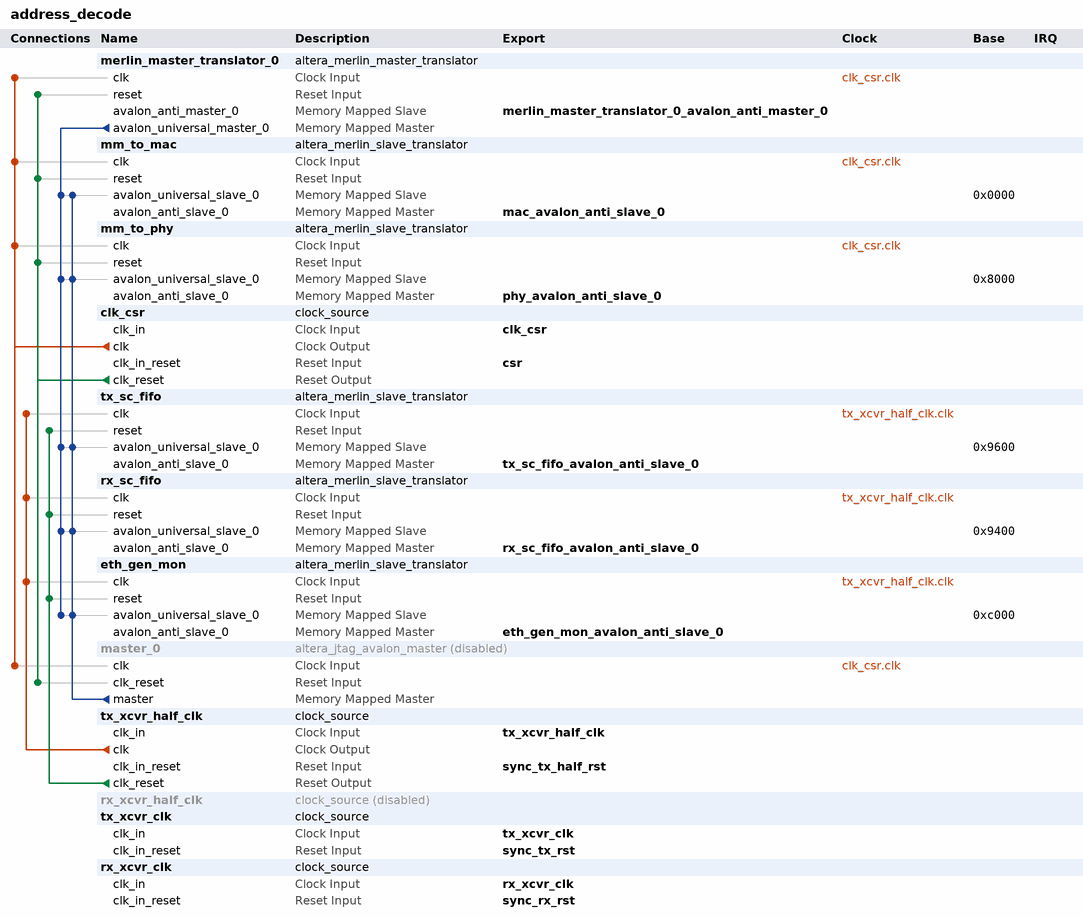
[diagram p0: system contents]
# Platform Designer (Qsys) system address_decode, Arria 10 10AX115N3F40E2SG
# Parameters at their usual value, and those the tool derives, are not listed.
package require -exact qsys 17.0
create_system address_decode
set_project_property DEVICE_FAMILY {Arria 10}
set_project_property DEVICE 10AX115N3F40E2SG

add_instance merlin_master_translator_0 altera_merlin_master_translator 17.0
set_instance_parameter_value merlin_master_translator_0 AV_ADDRESSGROUP 0
set_instance_parameter_value merlin_master_translator_0 AV_ADDRESS_SYMBOLS 0
set_instance_parameter_value merlin_master_translator_0 AV_ADDRESS_W 16
set_instance_parameter_value merlin_master_translator_0 AV_ALWAYSBURSTMAXBURST 0
set_instance_parameter_value merlin_master_translator_0 AV_BITS_PER_SYMBOL 8
set_instance_parameter_value merlin_master_translator_0 AV_BURSTBOUNDARIES 0
set_instance_parameter_value merlin_master_translator_0 AV_BURSTCOUNT_SYMBOLS 0
set_instance_parameter_value merlin_master_translator_0 AV_BURSTCOUNT_W 1
set_instance_parameter_value merlin_master_translator_0 AV_BYTEENABLE_W 4
set_instance_parameter_value merlin_master_translator_0 AV_CONSTANT_BURST_BEHAVIOR 0
set_instance_parameter_value merlin_master_translator_0 AV_DATA_HOLD 0
set_instance_parameter_value merlin_master_translator_0 AV_DATA_W 32
set_instance_parameter_value merlin_master_translator_0 AV_INTERLEAVEBURSTS 0
set_instance_parameter_value merlin_master_translator_0 AV_ISBIGENDIAN 0
set_instance_parameter_value merlin_master_translator_0 AV_LINEWRAPBURSTS 0
set_instance_parameter_value merlin_master_translator_0 AV_MAX_PENDING_READ_TRANSACTIONS 0
set_instance_parameter_value merlin_master_translator_0 AV_READLATENCY 0
set_instance_parameter_value merlin_master_translator_0 AV_READ_WAIT 0
set_instance_parameter_value merlin_master_translator_0 AV_REGISTERINCOMINGSIGNALS 0
set_instance_parameter_value merlin_master_translator_0 AV_REGISTEROUTGOINGSIGNALS 0
set_instance_parameter_value merlin_master_translator_0 AV_SETUP_WAIT 0
set_instance_parameter_value merlin_master_translator_0 AV_SYMBOLS_PER_WORD 4
set_instance_parameter_value merlin_master_translator_0 AV_WRITE_WAIT 0
set_instance_parameter_value merlin_master_translator_0 SYNC_RESET 0
set_instance_parameter_value merlin_master_translator_0 UAV_ADDRESSGROUP 0
set_instance_parameter_value merlin_master_translator_0 UAV_ADDRESS_W 32
set_instance_parameter_value merlin_master_translator_0 UAV_BURSTCOUNT_W 10
set_instance_parameter_value merlin_master_translator_0 UAV_CONSTANT_BURST_BEHAVIOR 0
set_instance_parameter_value merlin_master_translator_0 USE_ADDRESS 1
set_instance_parameter_value merlin_master_translator_0 USE_BEGINBURSTTRANSFER 0
set_instance_parameter_value merlin_master_translator_0 USE_BEGINTRANSFER 0
set_instance_parameter_value merlin_master_translator_0 USE_BURSTCOUNT 0
set_instance_parameter_value merlin_master_translator_0 USE_BYTEENABLE 0
set_instance_parameter_value merlin_master_translator_0 USE_CHIPSELECT 0
set_instance_parameter_value merlin_master_translator_0 USE_CLKEN 0
set_instance_parameter_value merlin_master_translator_0 USE_DEBUGACCESS 0
set_instance_parameter_value merlin_master_translator_0 USE_LOCK 0
set_instance_parameter_value merlin_master_translator_0 USE_READ 1
set_instance_parameter_value merlin_master_translator_0 USE_READDATA 1
set_instance_parameter_value merlin_master_translator_0 USE_READDATAVALID 0
set_instance_parameter_value merlin_master_translator_0 USE_READRESPONSE 0
set_instance_parameter_value merlin_master_translator_0 USE_WAITREQUEST 1
set_instance_parameter_value merlin_master_translator_0 USE_WRITE 1
set_instance_parameter_value merlin_master_translator_0 USE_WRITEDATA 1
set_instance_parameter_value merlin_master_translator_0 USE_WRITERESPONSE 0

add_instance mm_to_mac altera_merlin_slave_translator 17.0
set_instance_parameter_value mm_to_mac AV_ADDRESSGROUP 0
set_instance_parameter_value mm_to_mac AV_ADDRESS_SYMBOLS 0
set_instance_parameter_value mm_to_mac AV_ADDRESS_W 13
set_instance_parameter_value mm_to_mac AV_ALWAYSBURSTMAXBURST 0
set_instance_parameter_value mm_to_mac AV_BITS_PER_SYMBOL 8
set_instance_parameter_value mm_to_mac AV_BURSTBOUNDARIES 0
set_instance_parameter_value mm_to_mac AV_BURSTCOUNT_SYMBOLS 0
set_instance_parameter_value mm_to_mac AV_BURSTCOUNT_W 4
set_instance_parameter_value mm_to_mac AV_BYTEENABLE_W 4
set_instance_parameter_value mm_to_mac AV_CONSTANT_BURST_BEHAVIOR 0
set_instance_parameter_value mm_to_mac AV_DATA_HOLD 0
set_instance_parameter_value mm_to_mac AV_DATA_W 32
set_instance_parameter_value mm_to_mac AV_INTERLEAVEBURSTS 0
set_instance_parameter_value mm_to_mac AV_ISBIGENDIAN 0
set_instance_parameter_value mm_to_mac AV_LINEWRAPBURSTS 0
set_instance_parameter_value mm_to_mac AV_MAX_PENDING_READ_TRANSACTIONS 64
set_instance_parameter_value mm_to_mac AV_MAX_PENDING_WRITE_TRANSACTIONS 0
set_instance_parameter_value mm_to_mac AV_READLATENCY 0
set_instance_parameter_value mm_to_mac AV_READ_WAIT 1
set_instance_parameter_value mm_to_mac AV_REGISTERINCOMINGSIGNALS 0
set_instance_parameter_value mm_to_mac AV_REGISTEROUTGOINGSIGNALS 0
set_instance_parameter_value mm_to_mac AV_REQUIRE_UNALIGNED_ADDRESSES 0
set_instance_parameter_value mm_to_mac AV_SETUP_WAIT 0
set_instance_parameter_value mm_to_mac AV_SYMBOLS_PER_WORD 4
set_instance_parameter_value mm_to_mac AV_TIMING_UNITS 1
set_instance_parameter_value mm_to_mac AV_WRITE_WAIT 0
set_instance_parameter_value mm_to_mac CHIPSELECT_THROUGH_READLATENCY 0
set_instance_parameter_value mm_to_mac CLOCK_RATE 125000000
set_instance_parameter_value mm_to_mac UAV_ADDRESSGROUP 0
set_instance_parameter_value mm_to_mac UAV_ADDRESS_W 15
set_instance_parameter_value mm_to_mac UAV_BURSTCOUNT_W 4
set_instance_parameter_value mm_to_mac UAV_BYTEENABLE_W 4
set_instance_parameter_value mm_to_mac UAV_CONSTANT_BURST_BEHAVIOR 0
set_instance_parameter_value mm_to_mac UAV_DATA_W 32
set_instance_parameter_value mm_to_mac USE_ADDRESS 1
set_instance_parameter_value mm_to_mac USE_AV_CLKEN 0
set_instance_parameter_value mm_to_mac USE_BEGINBURSTTRANSFER 0
set_instance_parameter_value mm_to_mac USE_BEGINTRANSFER 0
set_instance_parameter_value mm_to_mac USE_BURSTCOUNT 0
set_instance_parameter_value mm_to_mac USE_BYTEENABLE 0
set_instance_parameter_value mm_to_mac USE_CHIPSELECT 0
set_instance_parameter_value mm_to_mac USE_DEBUGACCESS 0
set_instance_parameter_value mm_to_mac USE_LOCK 0
set_instance_parameter_value mm_to_mac USE_OUTPUTENABLE 0
set_instance_parameter_value mm_to_mac USE_READ 1
set_instance_parameter_value mm_to_mac USE_READDATA 1
set_instance_parameter_value mm_to_mac USE_READDATAVALID 0
set_instance_parameter_value mm_to_mac USE_READRESPONSE 0
set_instance_parameter_value mm_to_mac USE_UAV_CLKEN 0
set_instance_parameter_value mm_to_mac USE_WAITREQUEST 1
set_instance_parameter_value mm_to_mac USE_WRITE 1
set_instance_parameter_value mm_to_mac USE_WRITEBYTEENABLE 0
set_instance_parameter_value mm_to_mac USE_WRITEDATA 1
set_instance_parameter_value mm_to_mac USE_WRITERESPONSE 0

add_instance mm_to_phy altera_merlin_slave_translator 17.0
set_instance_parameter_value mm_to_phy AV_ADDRESSGROUP 0
set_instance_parameter_value mm_to_phy AV_ADDRESS_SYMBOLS 0
set_instance_parameter_value mm_to_phy AV_ADDRESS_W 10
set_instance_parameter_value mm_to_phy AV_ALWAYSBURSTMAXBURST 0
set_instance_parameter_value mm_to_phy AV_BITS_PER_SYMBOL 8
set_instance_parameter_value mm_to_phy AV_BURSTBOUNDARIES 0
set_instance_parameter_value mm_to_phy AV_BURSTCOUNT_SYMBOLS 0
set_instance_parameter_value mm_to_phy AV_BURSTCOUNT_W 4
set_instance_parameter_value mm_to_phy AV_BYTEENABLE_W 4
set_instance_parameter_value mm_to_phy AV_CONSTANT_BURST_BEHAVIOR 0
set_instance_parameter_value mm_to_phy AV_DATA_HOLD 0
set_instance_parameter_value mm_to_phy AV_DATA_W 32
set_instance_parameter_value mm_to_phy AV_INTERLEAVEBURSTS 0
set_instance_parameter_value mm_to_phy AV_ISBIGENDIAN 0
set_instance_parameter_value mm_to_phy AV_LINEWRAPBURSTS 0
set_instance_parameter_value mm_to_phy AV_MAX_PENDING_READ_TRANSACTIONS 64
set_instance_parameter_value mm_to_phy AV_MAX_PENDING_WRITE_TRANSACTIONS 0
set_instance_parameter_value mm_to_phy AV_READLATENCY 0
set_instance_parameter_value mm_to_phy AV_READ_WAIT 1
set_instance_parameter_value mm_to_phy AV_REGISTERINCOMINGSIGNALS 0
set_instance_parameter_value mm_to_phy AV_REGISTEROUTGOINGSIGNALS 0
set_instance_parameter_value mm_to_phy AV_REQUIRE_UNALIGNED_ADDRESSES 0
set_instance_parameter_value mm_to_phy AV_SETUP_WAIT 0
set_instance_parameter_value mm_to_phy AV_SYMBOLS_PER_WORD 4
set_instance_parameter_value mm_to_phy AV_TIMING_UNITS 1
set_instance_parameter_value mm_to_phy AV_WRITE_WAIT 0
set_instance_parameter_value mm_to_phy CHIPSELECT_THROUGH_READLATENCY 0
set_instance_parameter_value mm_to_phy CLOCK_RATE 125000000
set_instance_parameter_value mm_to_phy UAV_ADDRESSGROUP 0
set_instance_parameter_value mm_to_phy UAV_ADDRESS_W 12
set_instance_parameter_value mm_to_phy UAV_BURSTCOUNT_W 4
set_instance_parameter_value mm_to_phy UAV_BYTEENABLE_W 4
set_instance_parameter_value mm_to_phy UAV_CONSTANT_BURST_BEHAVIOR 0
set_instance_parameter_value mm_to_phy UAV_DATA_W 32
set_instance_parameter_value mm_to_phy USE_ADDRESS 1
set_instance_parameter_value mm_to_phy USE_AV_CLKEN 0
set_instance_parameter_value mm_to_phy USE_BEGINBURSTTRANSFER 0
set_instance_parameter_value mm_to_phy USE_BEGINTRANSFER 0
set_instance_parameter_value mm_to_phy USE_BURSTCOUNT 0
set_instance_parameter_value mm_to_phy USE_BYTEENABLE 0
set_instance_parameter_value mm_to_phy USE_CHIPSELECT 0
set_instance_parameter_value mm_to_phy USE_DEBUGACCESS 0
set_instance_parameter_value mm_to_phy USE_LOCK 0
set_instance_parameter_value mm_to_phy USE_OUTPUTENABLE 0
set_instance_parameter_value mm_to_phy USE_READ 1
set_instance_parameter_value mm_to_phy USE_READDATA 1
set_instance_parameter_value mm_to_phy USE_READDATAVALID 0
set_instance_parameter_value mm_to_phy USE_READRESPONSE 0
set_instance_parameter_value mm_to_phy USE_UAV_CLKEN 0
set_instance_parameter_value mm_to_phy USE_WAITREQUEST 1
set_instance_parameter_value mm_to_phy USE_WRITE 1
set_instance_parameter_value mm_to_phy USE_WRITEBYTEENABLE 0
set_instance_parameter_value mm_to_phy USE_WRITEDATA 1
set_instance_parameter_value mm_to_phy USE_WRITERESPONSE 0

add_instance clk_csr clock_source 17.0
set_instance_parameter_value clk_csr clockFrequency 125000000
set_instance_parameter_value clk_csr resetSynchronousEdges DEASSERT

add_instance tx_sc_fifo altera_merlin_slave_translator 17.0
set_instance_parameter_value tx_sc_fifo AV_ADDRESSGROUP 0
set_instance_parameter_value tx_sc_fifo AV_ADDRESS_SYMBOLS 0
set_instance_parameter_value tx_sc_fifo AV_ADDRESS_W 3
set_instance_parameter_value tx_sc_fifo AV_ALWAYSBURSTMAXBURST 0
set_instance_parameter_value tx_sc_fifo AV_BITS_PER_SYMBOL 8
set_instance_parameter_value tx_sc_fifo AV_BURSTBOUNDARIES 0
set_instance_parameter_value tx_sc_fifo AV_BURSTCOUNT_SYMBOLS 0
set_instance_parameter_value tx_sc_fifo AV_BURSTCOUNT_W 4
set_instance_parameter_value tx_sc_fifo AV_BYTEENABLE_W 4
set_instance_parameter_value tx_sc_fifo AV_CONSTANT_BURST_BEHAVIOR 0
set_instance_parameter_value tx_sc_fifo AV_DATA_HOLD 0
set_instance_parameter_value tx_sc_fifo AV_DATA_W 32
set_instance_parameter_value tx_sc_fifo AV_INTERLEAVEBURSTS 0
set_instance_parameter_value tx_sc_fifo AV_ISBIGENDIAN 0
set_instance_parameter_value tx_sc_fifo AV_LINEWRAPBURSTS 0
set_instance_parameter_value tx_sc_fifo AV_MAX_PENDING_READ_TRANSACTIONS 64
set_instance_parameter_value tx_sc_fifo AV_MAX_PENDING_WRITE_TRANSACTIONS 0
set_instance_parameter_value tx_sc_fifo AV_READLATENCY 0
set_instance_parameter_value tx_sc_fifo AV_READ_WAIT 1
set_instance_parameter_value tx_sc_fifo AV_REGISTERINCOMINGSIGNALS 0
set_instance_parameter_value tx_sc_fifo AV_REGISTEROUTGOINGSIGNALS 0
set_instance_parameter_value tx_sc_fifo AV_REQUIRE_UNALIGNED_ADDRESSES 0
set_instance_parameter_value tx_sc_fifo AV_SETUP_WAIT 0
set_instance_parameter_value tx_sc_fifo AV_SYMBOLS_PER_WORD 4
set_instance_parameter_value tx_sc_fifo AV_TIMING_UNITS 1
set_instance_parameter_value tx_sc_fifo AV_WRITE_WAIT 0
set_instance_parameter_value tx_sc_fifo CHIPSELECT_THROUGH_READLATENCY 0
set_instance_parameter_value tx_sc_fifo CLOCK_RATE 161132800
set_instance_parameter_value tx_sc_fifo UAV_ADDRESSGROUP 0
set_instance_parameter_value tx_sc_fifo UAV_ADDRESS_W 5
set_instance_parameter_value tx_sc_fifo UAV_BURSTCOUNT_W 4
set_instance_parameter_value tx_sc_fifo UAV_BYTEENABLE_W 4
set_instance_parameter_value tx_sc_fifo UAV_CONSTANT_BURST_BEHAVIOR 0
set_instance_parameter_value tx_sc_fifo UAV_DATA_W 32
set_instance_parameter_value tx_sc_fifo USE_ADDRESS 1
set_instance_parameter_value tx_sc_fifo USE_AV_CLKEN 0
set_instance_parameter_value tx_sc_fifo USE_BEGINBURSTTRANSFER 0
set_instance_parameter_value tx_sc_fifo USE_BEGINTRANSFER 0
set_instance_parameter_value tx_sc_fifo USE_BURSTCOUNT 0
set_instance_parameter_value tx_sc_fifo USE_BYTEENABLE 0
set_instance_parameter_value tx_sc_fifo USE_CHIPSELECT 0
set_instance_parameter_value tx_sc_fifo USE_DEBUGACCESS 0
set_instance_parameter_value tx_sc_fifo USE_LOCK 0
set_instance_parameter_value tx_sc_fifo USE_OUTPUTENABLE 0
set_instance_parameter_value tx_sc_fifo USE_READ 1
set_instance_parameter_value tx_sc_fifo USE_READDATA 1
set_instance_parameter_value tx_sc_fifo USE_READDATAVALID 0
set_instance_parameter_value tx_sc_fifo USE_READRESPONSE 0
set_instance_parameter_value tx_sc_fifo USE_UAV_CLKEN 0
set_instance_parameter_value tx_sc_fifo USE_WAITREQUEST 0
set_instance_parameter_value tx_sc_fifo USE_WRITE 1
set_instance_parameter_value tx_sc_fifo USE_WRITEBYTEENABLE 0
set_instance_parameter_value tx_sc_fifo USE_WRITEDATA 1
set_instance_parameter_value tx_sc_fifo USE_WRITERESPONSE 0

add_instance rx_sc_fifo altera_merlin_slave_translator 17.0
set_instance_parameter_value rx_sc_fifo AV_ADDRESSGROUP 0
set_instance_parameter_value rx_sc_fifo AV_ADDRESS_SYMBOLS 0
set_instance_parameter_value rx_sc_fifo AV_ADDRESS_W 3
set_instance_parameter_value rx_sc_fifo AV_ALWAYSBURSTMAXBURST 0
set_instance_parameter_value rx_sc_fifo AV_BITS_PER_SYMBOL 8
set_instance_parameter_value rx_sc_fifo AV_BURSTBOUNDARIES 0
set_instance_parameter_value rx_sc_fifo AV_BURSTCOUNT_SYMBOLS 0
set_instance_parameter_value rx_sc_fifo AV_BURSTCOUNT_W 4
set_instance_parameter_value rx_sc_fifo AV_BYTEENABLE_W 4
set_instance_parameter_value rx_sc_fifo AV_CONSTANT_BURST_BEHAVIOR 0
set_instance_parameter_value rx_sc_fifo AV_DATA_HOLD 0
set_instance_parameter_value rx_sc_fifo AV_DATA_W 32
set_instance_parameter_value rx_sc_fifo AV_INTERLEAVEBURSTS 0
set_instance_parameter_value rx_sc_fifo AV_ISBIGENDIAN 0
set_instance_parameter_value rx_sc_fifo AV_LINEWRAPBURSTS 0
set_instance_parameter_value rx_sc_fifo AV_MAX_PENDING_READ_TRANSACTIONS 64
set_instance_parameter_value rx_sc_fifo AV_MAX_PENDING_WRITE_TRANSACTIONS 0
set_instance_parameter_value rx_sc_fifo AV_READLATENCY 0
set_instance_parameter_value rx_sc_fifo AV_READ_WAIT 1
set_instance_parameter_value rx_sc_fifo AV_REGISTERINCOMINGSIGNALS 0
set_instance_parameter_value rx_sc_fifo AV_REGISTEROUTGOINGSIGNALS 0
set_instance_parameter_value rx_sc_fifo AV_REQUIRE_UNALIGNED_ADDRESSES 0
set_instance_parameter_value rx_sc_fifo AV_SETUP_WAIT 0
set_instance_parameter_value rx_sc_fifo AV_SYMBOLS_PER_WORD 4
set_instance_parameter_value rx_sc_fifo AV_TIMING_UNITS 1
set_instance_parameter_value rx_sc_fifo AV_WRITE_WAIT 0
set_instance_parameter_value rx_sc_fifo CHIPSELECT_THROUGH_READLATENCY 0
set_instance_parameter_value rx_sc_fifo CLOCK_RATE 161132800
set_instance_parameter_value rx_sc_fifo UAV_ADDRESSGROUP 0
set_instance_parameter_value rx_sc_fifo UAV_ADDRESS_W 5
set_instance_parameter_value rx_sc_fifo UAV_BURSTCOUNT_W 4
set_instance_parameter_value rx_sc_fifo UAV_BYTEENABLE_W 4
set_instance_parameter_value rx_sc_fifo UAV_CONSTANT_BURST_BEHAVIOR 0
set_instance_parameter_value rx_sc_fifo UAV_DATA_W 32
set_instance_parameter_value rx_sc_fifo USE_ADDRESS 1
set_instance_parameter_value rx_sc_fifo USE_AV_CLKEN 0
set_instance_parameter_value rx_sc_fifo USE_BEGINBURSTTRANSFER 0
set_instance_parameter_value rx_sc_fifo USE_BEGINTRANSFER 0
set_instance_parameter_value rx_sc_fifo USE_BURSTCOUNT 0
set_instance_parameter_value rx_sc_fifo USE_BYTEENABLE 0
set_instance_parameter_value rx_sc_fifo USE_CHIPSELECT 0
set_instance_parameter_value rx_sc_fifo USE_DEBUGACCESS 0
set_instance_parameter_value rx_sc_fifo USE_LOCK 0
set_instance_parameter_value rx_sc_fifo USE_OUTPUTENABLE 0
set_instance_parameter_value rx_sc_fifo USE_READ 1
set_instance_parameter_value rx_sc_fifo USE_READDATA 1
set_instance_parameter_value rx_sc_fifo USE_READDATAVALID 0
set_instance_parameter_value rx_sc_fifo USE_READRESPONSE 0
set_instance_parameter_value rx_sc_fifo USE_UAV_CLKEN 0
set_instance_parameter_value rx_sc_fifo USE_WAITREQUEST 0
set_instance_parameter_value rx_sc_fifo USE_WRITE 1
set_instance_parameter_value rx_sc_fifo USE_WRITEBYTEENABLE 0
set_instance_parameter_value rx_sc_fifo USE_WRITEDATA 1
set_instance_parameter_value rx_sc_fifo USE_WRITERESPONSE 0

add_instance eth_gen_mon altera_merlin_slave_translator 17.0
set_instance_parameter_value eth_gen_mon AV_ADDRESSGROUP 0
set_instance_parameter_value eth_gen_mon AV_ADDRESS_SYMBOLS 1
set_instance_parameter_value eth_gen_mon AV_ADDRESS_W 12
set_instance_parameter_value eth_gen_mon AV_ALWAYSBURSTMAXBURST 0
set_instance_parameter_value eth_gen_mon AV_BITS_PER_SYMBOL 8
set_instance_parameter_value eth_gen_mon AV_BURSTBOUNDARIES 0
set_instance_parameter_value eth_gen_mon AV_BURSTCOUNT_SYMBOLS 1
set_instance_parameter_value eth_gen_mon AV_BURSTCOUNT_W 4
set_instance_parameter_value eth_gen_mon AV_BYTEENABLE_W 4
set_instance_parameter_value eth_gen_mon AV_CONSTANT_BURST_BEHAVIOR 0
set_instance_parameter_value eth_gen_mon AV_DATA_HOLD 0
set_instance_parameter_value eth_gen_mon AV_DATA_W 32
set_instance_parameter_value eth_gen_mon AV_INTERLEAVEBURSTS 0
set_instance_parameter_value eth_gen_mon AV_ISBIGENDIAN 0
set_instance_parameter_value eth_gen_mon AV_LINEWRAPBURSTS 0
set_instance_parameter_value eth_gen_mon AV_MAX_PENDING_READ_TRANSACTIONS 64
set_instance_parameter_value eth_gen_mon AV_MAX_PENDING_WRITE_TRANSACTIONS 0
set_instance_parameter_value eth_gen_mon AV_READLATENCY 0
set_instance_parameter_value eth_gen_mon AV_READ_WAIT 1
set_instance_parameter_value eth_gen_mon AV_REGISTERINCOMINGSIGNALS 0
set_instance_parameter_value eth_gen_mon AV_REGISTEROUTGOINGSIGNALS 0
set_instance_parameter_value eth_gen_mon AV_REQUIRE_UNALIGNED_ADDRESSES 0
set_instance_parameter_value eth_gen_mon AV_SETUP_WAIT 0
set_instance_parameter_value eth_gen_mon AV_SYMBOLS_PER_WORD 4
set_instance_parameter_value eth_gen_mon AV_TIMING_UNITS 1
set_instance_parameter_value eth_gen_mon AV_WRITE_WAIT 0
set_instance_parameter_value eth_gen_mon CHIPSELECT_THROUGH_READLATENCY 0
set_instance_parameter_value eth_gen_mon CLOCK_RATE 161132800
set_instance_parameter_value eth_gen_mon UAV_ADDRESSGROUP 0
set_instance_parameter_value eth_gen_mon UAV_ADDRESS_W 14
set_instance_parameter_value eth_gen_mon UAV_BURSTCOUNT_W 4
set_instance_parameter_value eth_gen_mon UAV_BYTEENABLE_W 4
set_instance_parameter_value eth_gen_mon UAV_CONSTANT_BURST_BEHAVIOR 0
set_instance_parameter_value eth_gen_mon UAV_DATA_W 32
set_instance_parameter_value eth_gen_mon USE_ADDRESS 1
set_instance_parameter_value eth_gen_mon USE_AV_CLKEN 0
set_instance_parameter_value eth_gen_mon USE_BEGINBURSTTRANSFER 0
set_instance_parameter_value eth_gen_mon USE_BEGINTRANSFER 0
set_instance_parameter_value eth_gen_mon USE_BURSTCOUNT 0
set_instance_parameter_value eth_gen_mon USE_BYTEENABLE 0
set_instance_parameter_value eth_gen_mon USE_CHIPSELECT 0
set_instance_parameter_value eth_gen_mon USE_DEBUGACCESS 0
set_instance_parameter_value eth_gen_mon USE_LOCK 0
set_instance_parameter_value eth_gen_mon USE_OUTPUTENABLE 0
set_instance_parameter_value eth_gen_mon USE_READ 1
set_instance_parameter_value eth_gen_mon USE_READDATA 1
set_instance_parameter_value eth_gen_mon USE_READDATAVALID 0
set_instance_parameter_value eth_gen_mon USE_READRESPONSE 0
set_instance_parameter_value eth_gen_mon USE_UAV_CLKEN 0
set_instance_parameter_value eth_gen_mon USE_WAITREQUEST 1
set_instance_parameter_value eth_gen_mon USE_WRITE 1
set_instance_parameter_value eth_gen_mon USE_WRITEBYTEENABLE 0
set_instance_parameter_value eth_gen_mon USE_WRITEDATA 1
set_instance_parameter_value eth_gen_mon USE_WRITERESPONSE 0

add_instance master_0 altera_jtag_avalon_master 17.0
set_instance_property master_0 ENABLED false

add_instance tx_xcvr_half_clk clock_source 17.0
set_instance_parameter_value tx_xcvr_half_clk clockFrequency 161132800

add_instance rx_xcvr_half_clk clock_source 17.0
set_instance_property rx_xcvr_half_clk ENABLED false
set_instance_parameter_value rx_xcvr_half_clk clockFrequency 161132800

add_instance tx_xcvr_clk clock_source 17.0
set_instance_parameter_value tx_xcvr_clk clockFrequency 322265000

add_instance rx_xcvr_clk clock_source 17.0
set_instance_parameter_value rx_xcvr_clk clockFrequency 322265000

# connections
add_connection clk_csr.clk master_0.clk clock
add_connection clk_csr.clk merlin_master_translator_0.clk clock
add_connection clk_csr.clk mm_to_mac.clk clock
add_connection clk_csr.clk mm_to_phy.clk clock
add_connection tx_xcvr_half_clk.clk eth_gen_mon.clk clock
add_connection tx_xcvr_half_clk.clk rx_sc_fifo.clk clock
add_connection tx_xcvr_half_clk.clk tx_sc_fifo.clk clock
add_connection clk_csr.clk_reset master_0.clk_reset reset
add_connection clk_csr.clk_reset merlin_master_translator_0.reset reset
add_connection clk_csr.clk_reset mm_to_mac.reset reset
add_connection clk_csr.clk_reset mm_to_phy.reset reset
add_connection tx_xcvr_half_clk.clk_reset eth_gen_mon.reset reset
add_connection tx_xcvr_half_clk.clk_reset rx_sc_fifo.reset reset
add_connection tx_xcvr_half_clk.clk_reset tx_sc_fifo.reset reset
add_connection master_0.master eth_gen_mon.avalon_universal_slave_0 avalon
set_connection_parameter_value master_0.master/eth_gen_mon.avalon_universal_slave_0 baseAddress 0xc000
add_connection master_0.master mm_to_mac.avalon_universal_slave_0 avalon
set_connection_parameter_value master_0.master/mm_to_mac.avalon_universal_slave_0 baseAddress 0x0000
add_connection master_0.master mm_to_phy.avalon_universal_slave_0 avalon
set_connection_parameter_value master_0.master/mm_to_phy.avalon_universal_slave_0 baseAddress 0x8000
add_connection master_0.master rx_sc_fifo.avalon_universal_slave_0 avalon
set_connection_parameter_value master_0.master/rx_sc_fifo.avalon_universal_slave_0 baseAddress 0x9400
add_connection master_0.master tx_sc_fifo.avalon_universal_slave_0 avalon
set_connection_parameter_value master_0.master/tx_sc_fifo.avalon_universal_slave_0 baseAddress 0x9600
add_connection merlin_master_translator_0.avalon_universal_master_0 eth_gen_mon.avalon_universal_slave_0 avalon
set_connection_parameter_value merlin_master_translator_0.avalon_universal_master_0/eth_gen_mon.avalon_universal_slave_0 baseAddress 0xc000
add_connection merlin_master_translator_0.avalon_universal_master_0 mm_to_mac.avalon_universal_slave_0 avalon
set_connection_parameter_value merlin_master_translator_0.avalon_universal_master_0/mm_to_mac.avalon_universal_slave_0 baseAddress 0x0000
add_connection merlin_master_translator_0.avalon_universal_master_0 mm_to_phy.avalon_universal_slave_0 avalon
set_connection_parameter_value merlin_master_translator_0.avalon_universal_master_0/mm_to_phy.avalon_universal_slave_0 baseAddress 0x8000
add_connection merlin_master_translator_0.avalon_universal_master_0 rx_sc_fifo.avalon_universal_slave_0 avalon
set_connection_parameter_value merlin_master_translator_0.avalon_universal_master_0/rx_sc_fifo.avalon_universal_slave_0 baseAddress 0x9400
add_connection merlin_master_translator_0.avalon_universal_master_0 tx_sc_fifo.avalon_universal_slave_0 avalon
set_connection_parameter_value merlin_master_translator_0.avalon_universal_master_0/tx_sc_fifo.avalon_universal_slave_0 baseAddress 0x9600

# exported interfaces
add_interface clk_csr clock sink
set_interface_property clk_csr EXPORT_OF clk_csr.clk_in
add_interface csr reset sink
set_interface_property csr EXPORT_OF clk_csr.clk_in_reset
add_interface eth_gen_mon_avalon_anti_slave_0 avalon master
set_interface_property eth_gen_mon_avalon_anti_slave_0 EXPORT_OF eth_gen_mon.avalon_anti_slave_0
add_interface mac_avalon_anti_slave_0 avalon master
set_interface_property mac_avalon_anti_slave_0 EXPORT_OF mm_to_mac.avalon_anti_slave_0
add_interface merlin_master_translator_0_avalon_anti_master_0 avalon slave
set_interface_property merlin_master_translator_0_avalon_anti_master_0 EXPORT_OF merlin_master_translator_0.avalon_anti_master_0
add_interface phy_avalon_anti_slave_0 avalon master
set_interface_property phy_avalon_anti_slave_0 EXPORT_OF mm_to_phy.avalon_anti_slave_0
add_interface rx_sc_fifo_avalon_anti_slave_0 avalon master
set_interface_property rx_sc_fifo_avalon_anti_slave_0 EXPORT_OF rx_sc_fifo.avalon_anti_slave_0
add_interface rx_xcvr_clk clock sink
set_interface_property rx_xcvr_clk EXPORT_OF rx_xcvr_clk.clk_in
add_interface sync_rx_rst reset sink
set_interface_property sync_rx_rst EXPORT_OF rx_xcvr_clk.clk_in_reset
add_interface sync_tx_half_rst reset sink
set_interface_property sync_tx_half_rst EXPORT_OF tx_xcvr_half_clk.clk_in_reset
add_interface sync_tx_rst reset sink
set_interface_property sync_tx_rst EXPORT_OF tx_xcvr_clk.clk_in_reset
add_interface tx_sc_fifo_avalon_anti_slave_0 avalon master
set_interface_property tx_sc_fifo_avalon_anti_slave_0 EXPORT_OF tx_sc_fifo.avalon_anti_slave_0
add_interface tx_xcvr_clk clock sink
set_interface_property tx_xcvr_clk EXPORT_OF tx_xcvr_clk.clk_in
add_interface tx_xcvr_half_clk clock sink
set_interface_property tx_xcvr_half_clk EXPORT_OF tx_xcvr_half_clk.clk_in

set_interconnect_requirement {$system} qsys_mm.clockCrossingAdapter HANDSHAKE
set_interconnect_requirement {$system} qsys_mm.insertDefaultSlave FALSE
set_interconnect_requirement {$system} qsys_mm.maxAdditionalLatency 1

save_system address_decode.qsys
